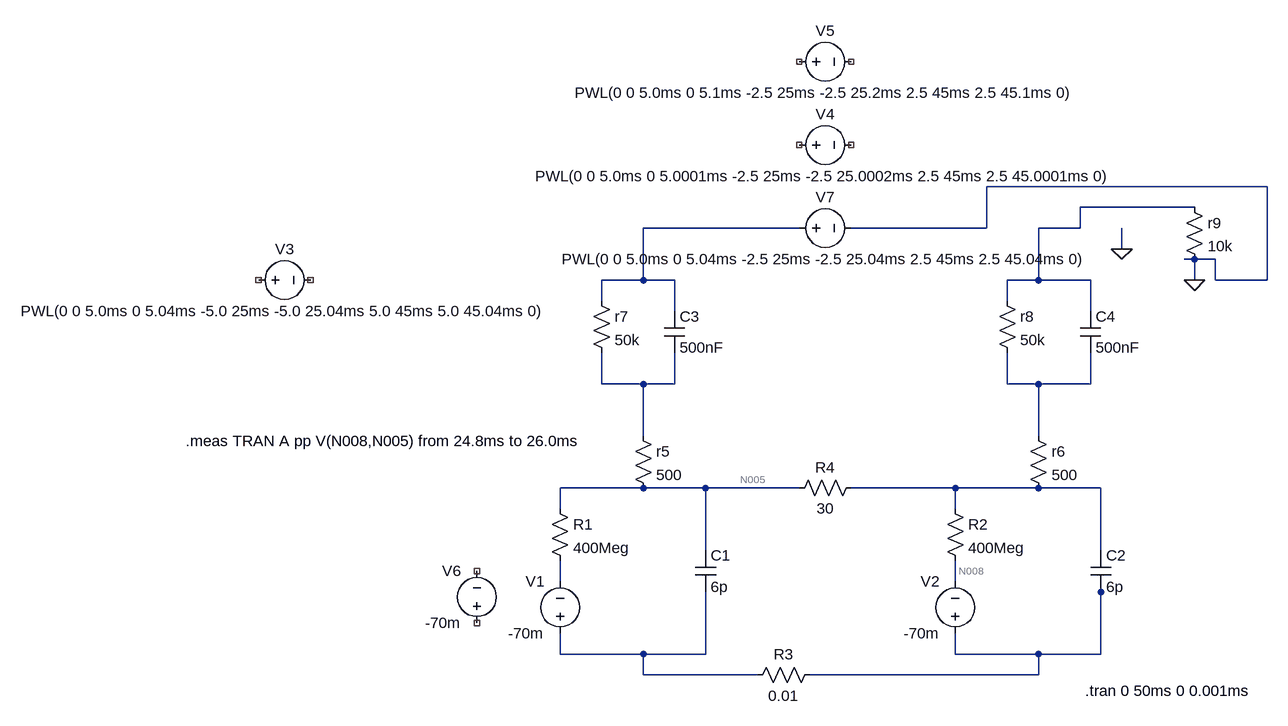
[diagram p0: schematic 電圧刺激等価回路_論文用_20210204_IV特性.asc]
電圧刺激等価回路_論文用_20210204_IV特性.asc, the LTspice schematic file:
Version 4
SHEET 1 1992 680
WIRE 1088 -432 656 -432
WIRE 976 -400 800 -400
WIRE 368 -368 128 -368
WIRE 656 -368 656 -432
WIRE 656 -368 448 -368
WIRE 800 -368 800 -400
WIRE 800 -368 736 -368
WIRE 864 -336 864 -368
WIRE 976 -320 960 -320
WIRE 1008 -320 976 -320
WIRE 128 -288 128 -368
WIRE 128 -288 64 -288
WIRE 176 -288 128 -288
WIRE 736 -288 736 -368
WIRE 736 -288 688 -288
WIRE 816 -288 736 -288
WIRE 976 -288 976 -320
WIRE 1008 -288 1008 -320
WIRE 1088 -288 1088 -432
WIRE 1088 -288 1008 -288
WIRE 64 -256 64 -288
WIRE 688 -256 688 -288
WIRE 176 -240 176 -288
WIRE 816 -240 816 -288
WIRE 64 -128 64 -176
WIRE 128 -128 64 -128
WIRE 176 -128 176 -176
WIRE 176 -128 128 -128
WIRE 688 -128 688 -176
WIRE 736 -128 688 -128
WIRE 816 -128 816 -176
WIRE 816 -128 736 -128
WIRE 128 -48 128 -128
WIRE 736 -48 736 -128
WIRE 128 32 0 32
WIRE 224 32 128 32
WIRE 368 32 224 32
WIRE 608 32 448 32
WIRE 736 32 608 32
WIRE 832 32 736 32
WIRE 0 64 0 32
WIRE 608 64 608 32
WIRE 224 128 224 32
WIRE 832 128 832 32
WIRE 0 176 0 144
WIRE 608 176 608 144
WIRE 832 192 832 176
WIRE 0 288 0 256
WIRE 128 288 0 288
WIRE 224 288 224 192
WIRE 224 288 128 288
WIRE 608 288 608 256
WIRE 736 288 608 288
WIRE 832 288 832 192
WIRE 832 288 736 288
WIRE 128 320 128 288
WIRE 304 320 128 320
WIRE 736 320 736 288
WIRE 736 320 384 320
FLAG 864 -336 0
FLAG 976 -288 0
SYMBOL res -16 48 R0
SYMATTR InstName R1
SYMATTR Value 400Meg
SYMBOL res 592 48 R0
SYMATTR InstName R2
SYMATTR Value 400Meg
SYMBOL res 400 304 R90
WINDOW 0 0 56 VBottom 2
WINDOW 3 32 56 VTop 2
SYMATTR InstName R3
SYMATTR Value 0.01
SYMBOL res 112 -64 R0
SYMATTR InstName r5
SYMATTR Value 500
SYMBOL res 720 -64 R0
SYMATTR InstName r6
SYMATTR Value 500
SYMBOL cap 208 128 R0
SYMATTR InstName C1
SYMATTR Value 6p
SYMBOL cap 816 128 R0
SYMATTR InstName C2
SYMATTR Value 6p
SYMBOL cap 160 -240 R0
SYMATTR InstName C3
SYMATTR Value 500nF
SYMBOL cap 800 -240 R0
SYMATTR InstName C4
SYMATTR Value 500nF
SYMBOL res 48 -272 R0
SYMATTR InstName r7
SYMATTR Value 50k
SYMBOL res 672 -272 R0
SYMATTR InstName r8
SYMATTR Value 50k
SYMBOL voltage 0 272 R180
WINDOW 0 24 96 Left 2
WINDOW 3 24 16 Left 2
SYMATTR InstName V1
SYMATTR Value -70m
SYMBOL voltage 608 272 R180
WINDOW 0 24 96 Left 2
WINDOW 3 24 16 Left 2
SYMATTR InstName V2
SYMATTR Value -70m
SYMBOL voltage 352 -624 R270
WINDOW 0 32 56 VTop 2
WINDOW 3 -32 56 VBottom 2
WINDOW 123 0 0 Left 0
WINDOW 39 0 0 Left 0
SYMATTR InstName V5
SYMATTR Value PWL(0 0 5.0ms 0 5.1ms -2.5 25ms -2.5 25.2ms 2.5 45ms 2.5 45.1ms 0)
SYMBOL voltage 352 -496 R270
WINDOW 0 32 56 VTop 2
WINDOW 3 -32 56 VBottom 2
WINDOW 123 0 0 Left 0
WINDOW 39 0 0 Left 0
SYMATTR InstName V4
SYMATTR Value PWL(0 0 5.0ms 0 5.0001ms -2.5 25ms -2.5 25.0002ms 2.5 45ms 2.5 45.0001ms 0)
SYMBOL voltage -128 256 R180
WINDOW 0 24 96 Left 2
WINDOW 3 24 16 Left 2
SYMATTR InstName V6
SYMATTR Value -70m
SYMBOL voltage -480 -288 R270
WINDOW 0 32 56 VTop 2
WINDOW 3 -32 56 VBottom 2
WINDOW 123 0 0 Left 0
WINDOW 39 0 0 Left 0
SYMATTR InstName V3
SYMATTR Value PWL(0 0 5.0ms 0 5.04ms -5.0 25ms -5.0 25.04ms 5.0 45ms 5.0 45.04ms 0)
SYMBOL voltage 352 -368 R270
WINDOW 0 32 56 VTop 2
WINDOW 3 -32 56 VBottom 2
WINDOW 123 0 0 Left 0
WINDOW 39 0 0 Left 0
SYMATTR InstName V7
SYMATTR Value PWL(0 0 5.0ms 0 5.04ms -2.5 25ms -2.5 25.04ms 2.5 45ms 2.5 45.04ms 0)
SYMBOL res 352 48 R270
WINDOW 0 32 56 VTop 2
WINDOW 3 0 56 VBottom 2
SYMATTR InstName R4
SYMATTR Value 30
SYMBOL res 960 -416 R0
SYMATTR InstName r9
SYMATTR Value 10k
TEXT 808 344 Left 2 !.tran 0 50ms 0 0.001ms
TEXT -576 -40 Left 2 !.meas TRAN A pp V(N008,N005) from 24.8ms to 26.0ms

The netlist it stands for:
* 電圧刺激等価回路_論文用_20210204_IV特性.asc
R1 N005 N007 400Meg
R2 N006 N008 400Meg
R3 N009 N010 0.01
r5 N003 N005 500
r6 N004 N006 500
C1 N005 N010 6p
C2 N006 N009 6p
C3 N002 N003 500nF
C4 N001 N004 500nF
r7 N002 N003 50k
r8 N001 N004 50k
V1 N010 N007 -70m
V2 N009 N008 -70m
V5 NC_01 NC_02 PWL(0 0 5.0ms 0 5.1ms -2.5 25ms -2.5 25.2ms 2.5 45ms 2.5 45.1ms 0)
V4 NC_03 NC_04 PWL(0 0 5.0ms 0 5.0001ms -2.5 25ms -2.5 25.0002ms 2.5 45ms 2.5 45.0001ms 0)
V6 NC_05 NC_06 -70m
V3 NC_07 NC_08 PWL(0 0 5.0ms 0 5.04ms -5.0 25ms -5.0 25.04ms 5.0 45ms 5.0 45.04ms 0)
V7 N002 0 PWL(0 0 5.0ms 0 5.04ms -2.5 25ms -2.5 25.04ms 2.5 45ms 2.5 45.04ms 0)
R4 N005 N006 30
r9 N001 0 10k
.tran 0 50ms 0 0.001ms
.meas TRAN A pp V(N008,N005) from 24.8ms to 26.0ms
.backanno
.end